# Altium project BSU.PrjPcb (part 1 of 2)
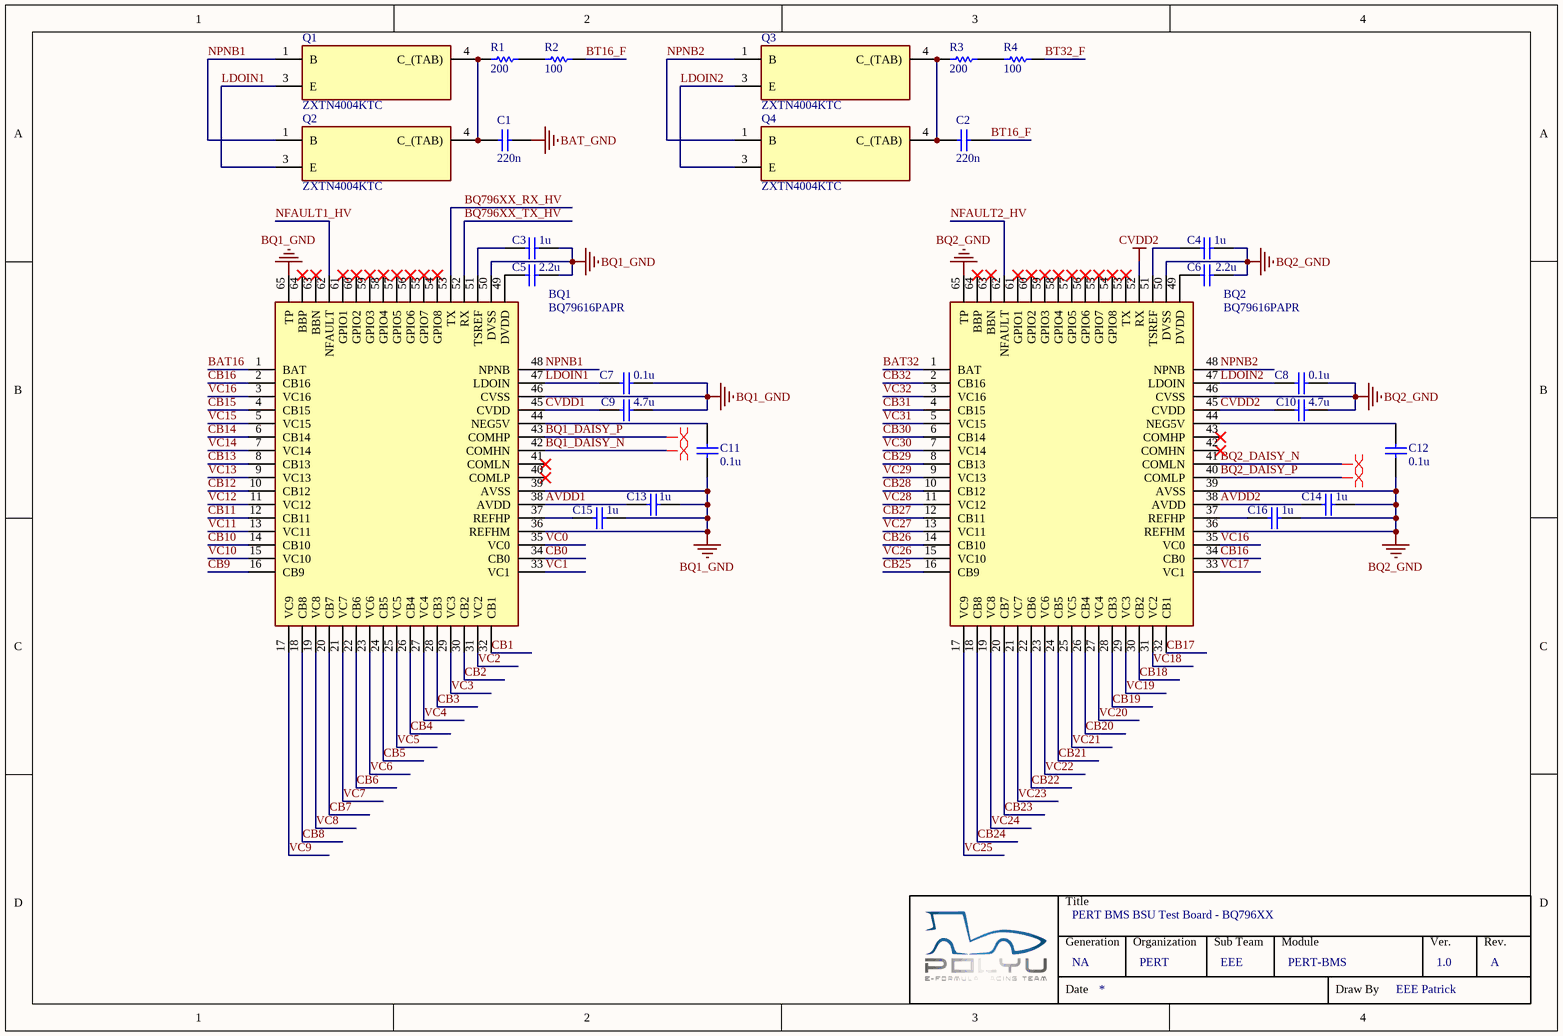
[diagram p0: BSU_BQ796XX.SchDoc]
PERTTitle: PERT BMS BSU Test Board; PERT-Version: 1.0; PERT-SubTeam: EEE; PERT-Revision: A; PERT-Organization: PERT; PERT-Module: PERT-BMS; PERT-Generation: NA; PERT-DrawBy: EEE Patrick
8 sheets, 358 parts. Net scope: global (net labels, ports and power ports of the same name join across sheets).
Board file: BSU.PcbDoc
Sheets:
  BSU_BQ796XX.SchDoc
  BSU_Connector.SchDoc
  BSU_Power.SchDoc
  BSU_Comm.SchDoc
  BSU_Sensing.SchDoc
  BSU_ESD.SchDoc
  BSU_EADC.SchDoc
  BSU_RTD.SchDoc

## Sheet BSU_BQ796XX.SchDoc: BQ796XX
size A4; Version: 1.0; Sub Team: EEE; Module: BMS; Generation: NA; Organization: PERT; SheetNumber: 1; SheetTotal: 8

### Parts
BQ1  BQ79616PAPR  [HTQFP65_BQ79616]
BQ2  BQ79616PAPR  [HTQFP65_BQ79616]
C1  220n  [1210_SMD_C]
C2  220n  [1210_SMD_C]
C3  1u  [0603_SMD_C]
C4  1u  [0603_SMD_C]
C5  2.2u  [0603_SMD_C]
C6  2.2u  [0603_SMD_C]
C7  0.1u  [0603_SMD_C]
C8  0.1u  [0603_SMD_C]
C9  4.7u  [0603_SMD_C]
C10  4.7u  [0603_SMD_C]
C11  0.1u  [0603_SMD_C]
C12  0.1u  [0603_SMD_C]
C13  1u  [0603_SMD_C]
C14  1u  [0603_SMD_C]
C15  1u  [0603_SMD_C]
C16  1u  [0603_SMD_C]
Q1  ZXTN4004KTC  [TO252-3_ZXTN4004K]
Q2  ZXTN4004KTC  [TO252-3_ZXTN4004K]
Q3  ZXTN4004KTC  [TO252-3_ZXTN4004K]
Q4  ZXTN4004KTC  [TO252-3_ZXTN4004K]
R1  200  [2010_SMD_R]
R2  100  [2010_SMD_R]
R3  200  [2010_SMD_R]
R4  100  [2010_SMD_R]

### Nets
BAT_GND: C1.2
BQ1_GND: BQ1.36(REFHM) BQ1.39(AVSS) BQ1.46(CVSS) BQ1.50(DVSS) BQ1.65(TP) C3.2 C5.2 C7.1 C9.2 C11.1 C13.1 C15.1
BQ2_GND: BQ2.36(REFHM) BQ2.39(AVSS) BQ2.46(CVSS) BQ2.50(DVSS) BQ2.65(TP) C4.2 C6.2 C8.1 C10.2 C12.1 C14.1 C16.1
CVDD1: BQ1.45(CVDD) C9.1
CVDD2: BQ2.45(CVDD) BQ2.52(RX) C10.1
AVDD1: BQ1.38(AVDD) C13.2
AVDD2: BQ2.38(AVDD) C14.2
BAT16: BQ1.1(BAT)
BAT32: BQ2.1(BAT)
BQ1_DAISY_N: BQ1.42(COMHN)
BQ1_DAISY_P: BQ1.43(COMHP)
BQ2_DAISY_N: BQ2.41(COMLN)
BQ2_DAISY_P: BQ2.40(COMLP)
BQ796XX_RX_HV: BQ1.53(TX)
BQ796XX_TX_HV: BQ1.52(RX)
BT16_F: C2.2 R2.2
BT32_F: R4.2
CB0: BQ1.34(CB0)
CB1: BQ1.32(CB1)
CB2: BQ1.30(CB2)
CB3: BQ1.28(CB3)
CB4: BQ1.26(CB4)
CB5: BQ1.24(CB5)
CB6: BQ1.22(CB6)
CB7: BQ1.20(CB7)
CB8: BQ1.18(CB8)
CB9: BQ1.16(CB9)
CB10: BQ1.14(CB10)
CB11: BQ1.12(CB11)
CB12: BQ1.10(CB12)
CB13: BQ1.8(CB13)
CB14: BQ1.6(CB14)
CB15: BQ1.4(CB15)
CB16: BQ1.2(CB16) BQ2.34(CB0)
CB17: BQ2.32(CB1)
CB18: BQ2.30(CB2)
CB19: BQ2.28(CB3)
CB20: BQ2.26(CB4)
CB21: BQ2.24(CB5)
CB22: BQ2.22(CB6)
CB23: BQ2.20(CB7)
CB24: BQ2.18(CB8)
CB25: BQ2.16(CB9)
CB26: BQ2.14(CB10)
CB27: BQ2.12(CB11)
CB28: BQ2.10(CB12)
CB29: BQ2.8(CB13)
CB30: BQ2.6(CB14)
CB31: BQ2.4(CB15)
CB32: BQ2.2(CB16)
LDOIN1: BQ1.47(LDOIN) C7.2 Q1.3(E) Q2.3(E)
LDOIN2: BQ2.47(LDOIN) C8.2 Q3.3(E) Q4.3(E)
NFAULT1_HV: BQ1.62(NFAULT)
NFAULT2_HV: BQ2.62(NFAULT)
NPNB1: BQ1.48(NPNB) Q1.1(B) Q2.1(B)
NPNB2: BQ2.48(NPNB) Q3.1(B) Q4.1(B)
VC0: BQ1.35(VC0)
VC1: BQ1.33(VC1)
VC2: BQ1.31(VC2)
VC3: BQ1.29(VC3)
VC4: BQ1.27(VC4)
VC5: BQ1.25(VC5)
VC6: BQ1.23(VC6)
VC7: BQ1.21(VC7)
VC8: BQ1.19(VC8)
VC9: BQ1.17(VC9)
VC10: BQ1.15(VC10)
VC11: BQ1.13(VC11)
VC12: BQ1.11(VC12)
VC13: BQ1.9(VC13)
VC14: BQ1.7(VC14)
VC15: BQ1.5(VC15)
VC16: BQ1.3(VC16) BQ2.35(VC0)
VC17: BQ2.33(VC1)
VC18: BQ2.31(VC2)
VC19: BQ2.29(VC3)
VC20: BQ2.27(VC4)
VC21: BQ2.25(VC5)
VC22: BQ2.23(VC6)
VC23: BQ2.21(VC7)
VC24: BQ2.19(VC8)
VC25: BQ2.17(VC9)
VC26: BQ2.15(VC10)
VC27: BQ2.13(VC11)
VC28: BQ2.11(VC12)
VC29: BQ2.9(VC13)
VC30: BQ2.7(VC14)
VC31: BQ2.5(VC15)
VC32: BQ2.3(VC16)
NetBQ1_37: BQ1.37(REFHP) C15.2
NetBQ1_44: BQ1.44(NEG5V) C11.2
NetBQ1_49: BQ1.49(DVDD) C5.1
NetBQ1_51: BQ1.51(TSREF) C3.1
NetBQ2_37: BQ2.37(REFHP) C16.2
NetBQ2_44: BQ2.44(NEG5V) C12.2
NetBQ2_49: BQ2.49(DVDD) C6.1
NetBQ2_51: BQ2.51(TSREF) C4.1
NetC1_1: C1.1 Q1.4(C_(TAB)) Q2.4(C_(TAB)) R1.1
NetC2_1: C2.1 Q3.4(C_(TAB)) Q4.4(C_(TAB)) R3.1
NetR1_2: R1.2 R2.1
NetR3_2: R3.2 R4.1

Not connected (* = marked no-connect by the designer): BQ1 40(COMLP)* 41(COMLN)* 54(GPIO8)* 55(GPIO7)* 56(GPIO6)* 57(GPIO5)* 58(GPIO4)* 59(GPIO3)* 60(GPIO2)* 61(GPIO1)* 63(BBN)* 64(BBP)*; BQ2 42(COMHN)* 43(COMHP)* 53(TX)* 54(GPIO8)* 55(GPIO7)* 56(GPIO6)* 57(GPIO5)* 58(GPIO4)* 59(GPIO3)* 60(GPIO2)* 61(GPIO1)* 63(BBN)* 64(BBP)*

### Layout directives
differential pair: BQ1_DAISY_N, BQ1_DAISY_P, BQ2_DAISY_N, BQ2_DAISY_P

### Notes on the sheet
- Title
- Generation
- Organization
- Sub Team
- Module
- Ver.
- Rev.
- Date
- Draw By

### Library data of the parts
BQ1 BQ2 = BQ79616PAPR: Battery Management 16-S precision battery monitor, balancer and integrated protector with stacking interface; Manufacturer_Name: Texas Instruments; Geometry.Height: 1.2mm; Mouser Part Number: 595-BQ79616PAPR; Mouser Price/Stock: https://www.mouser.co.uk/ProductDetail/Texas-Instruments/BQ79616PAPR?qs=1Kr7Jg1SGW8FUVDCFv5r0A%3D%3D; Manufacturer_Part_Number: BQ79616PAPR; Datasheet Link: https://www.ti.com/lit/ds/symlink/bq79616.pdf?ts=1694396292843&ref_url=https%253A%252F%252Fwww.ti.com%252Fproduct%252Fzh-tw%252FBQ79616
C1 C2 = 1210_SMD_Capacitor: 1210 SMD Capacitor; Voltage Rating: 100VDC; Tolerance: *; Dielectric: *; Value: 220n
C3-C16 = 0603_SMD_Capacitor: 0603 SMD Capacitor; Voltage Rating: 10VDC; Tolerance: *; Dielectric: *
  C3 C4 C13-C16: Value: 1u
  C5 C6: Value: 2.2u
  C7 C8 C11 C12: Value: 0.1u
  C9 C10: Value: 4.7u
Q1-Q4 = ZXTN4004KTC: Transistor; Manufacturer_Name: Diodes Incorporated; Datasheet Link: https://datasheet.datasheetarchive.com/originals/distributors/Datasheets-DGA18/1088694.pdf; Height: 2.39mm; Manufacturer_Part_Number: ZXTN4004KTC; Mouser Part Number: 621-ZXTN4004KTC; Mouser Price/Stock: https://www.mouser.co.uk/ProductDetail/Diodes-Incorporated/ZXTN4004KTC?qs=aXnpsjvrXd1NjskJTVsVYA%3D%3D; Arrow Part Number: ZXTN4004KTC; Arrow Price/Stock: https://www.arrow.com/en/products/zxtn4004ktc/diodes-incorporated?region=asia
R1-R4 = 2010_SMD_Resistor: 2010 SMD Resistor; Tolerance: *; Power Rating: *; Temperature Coefficient: *
  R1 R3: Value: 200
  R2 R4: Value: 100

## Sheet BSU_Connector.SchDoc: Connector
size A4; Version: 1.0; Sub Team: EEE; Module: PERT-BMS; Generation: NA; Organization: PERT; SheetNumber: 2; SheetTotal: 8
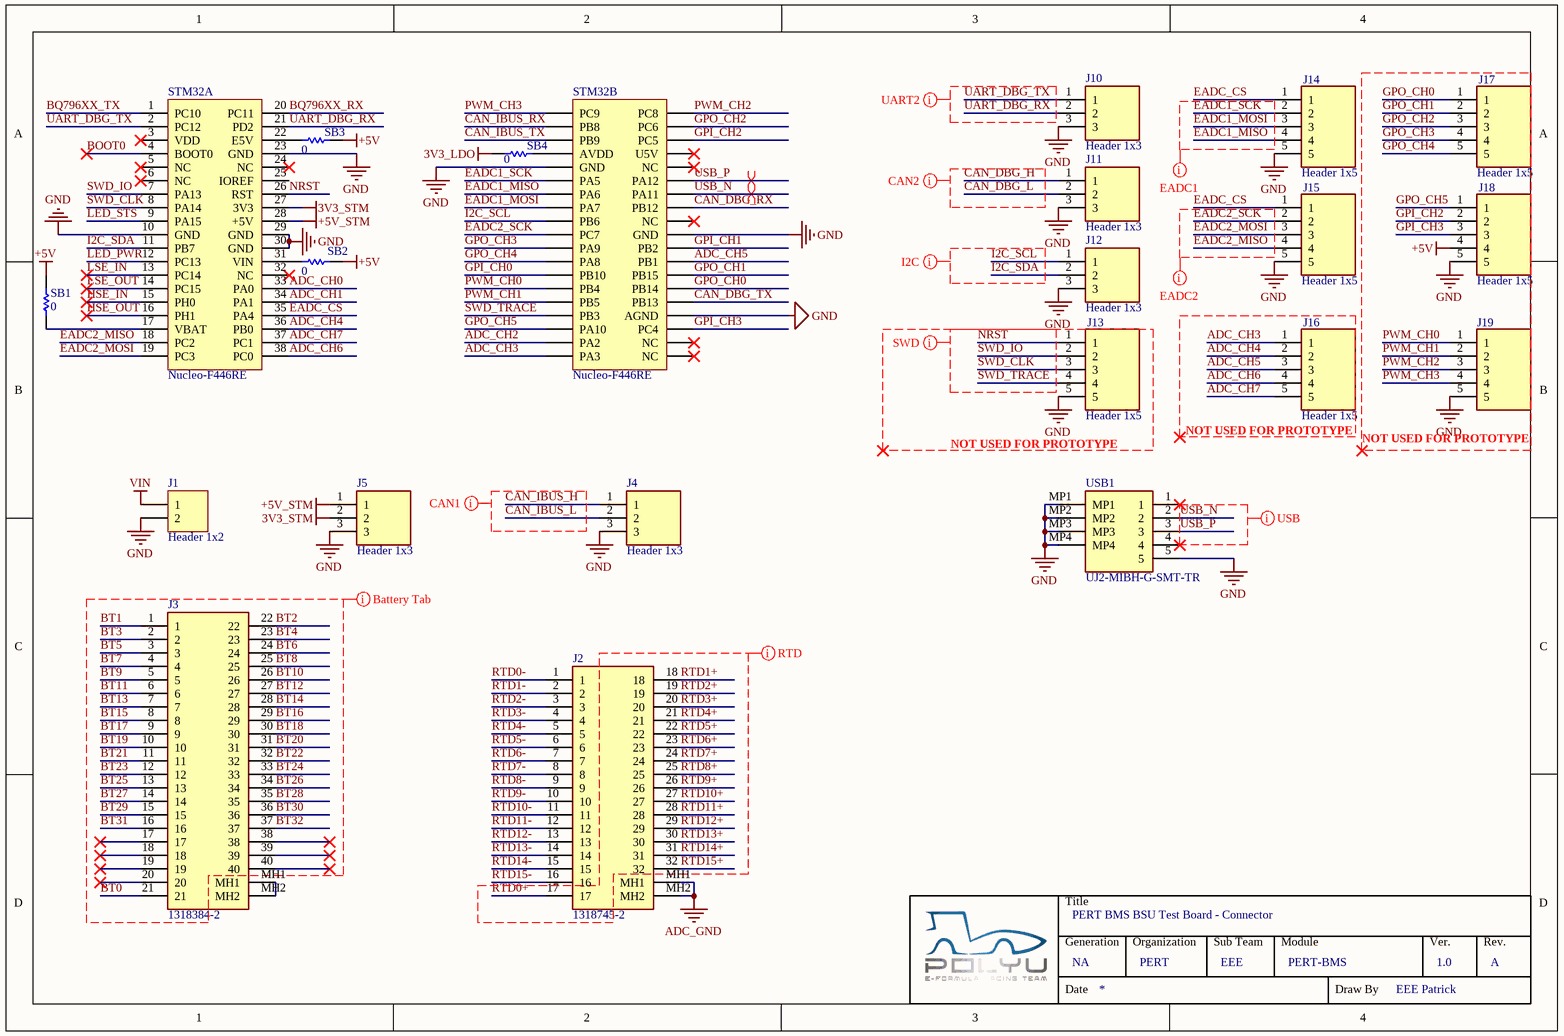
[diagram p1: BSU_Connector.SchDoc]

### Parts
J1  Header 1x2  [HDR_1X2_2.54_THD]
J2  1318745-2  [TH025_32P]
J3  1318384-2  [TH025_40P]
J4  Header 1x3  [HDR_1X3_2.54_THD]
J5  Header 1x3  [HDR_1X3_2.54_THD]
J10  Header 1x3  [HDR_1X3_2.54_THD]
J11  Header 1x3  [HDR_1X3_2.54_THD]
J12  Header 1x3  [HDR_1X3_2.54_THD]
J13  Header 1x5  [HDR_1X5_2.54_THD]  (graphical)
J14  Header 1x5  [HDR_1X5_2.54_THD]
J15  Header 1x5  [HDR_1X5_2.54_THD]
J16  Header 1x5  [HDR_1X5_2.54_THD]  (graphical)
J17  Header 1x5  [HDR_1X5_2.54_THD]  (graphical)
J18  Header 1x5  [HDR_1X5_2.54_THD]  (graphical)
J19  Header 1x5  [HDR_1X5_2.54_THD]  (value not drawn)  (graphical)
SB1  0  [0805_SMD_R]
SB2  0  [0805_SMD_R]
SB3  0  [0805_SMD_R]
SB4  0  [0805_SMD_R]
STM32  Nucleo-F446RE  [NUCLEO-F446RE]  (parts A,B of 2)  (no BOM)
USB1  UJ2-MIBH-G-SMT-TR  [USB_B_5P_SMD]

### Nets
3V3_LDO: SB4.2
3V3_STM: J5.2 STM32.27(3V3)
+5V: J18.4 SB1.2 SB2.1 SB3.1
+5V_STM: J5.1 STM32.28(+5V)
GND: J1.2 J4.3 J5.3 J10.3 J11.3 J12.3 J13.5 J14.5 J15.5 J18.5 J19.5 STM32.10(GND) STM32.23(GND) STM32.29(GND) STM32.30(GND) STM32.43(GND) STM32.67(GND) STM32.73(AGND) USB1.5 USB1.MP1 USB1.MP2 USB1.MP3 USB1.MP4
RTD0-: J2.1 J2.2 J2.3 J2.4 J2.5 J2.6 J2.7 J2.8 J2.9 J2.10 J2.11 J2.12 J2.13 J2.14 J2.15 J2.16 J2.MH1 J2.MH2  [also labelled ADC_GND, RTD1-, RTD10-, RTD11-, RTD12-, RTD13-, RTD14-, RTD15-, RTD2-, RTD3-, RTD4-, RTD5-, RTD6-, RTD7-, RTD8-, RTD9-]
VIN: J1.1
ADC_CH0: STM32.33(PA0)
ADC_CH1: STM32.34(PA1)
ADC_CH2: STM32.56(PA2)
ADC_CH3: J16.1 STM32.57(PA3)
ADC_CH4: J16.2 STM32.36(PB0)
ADC_CH5: J16.3 STM32.69(PB1)
ADC_CH6: J16.4 STM32.38(PC0)
ADC_CH7: J16.5 STM32.37(PC1)
BOOT0: STM32.4(BOOT0)
BQ796XX_RX: STM32.20(PC11)
BQ796XX_TX: STM32.1(PC10)
BT0: J3.21
BT1: J3.1
BT2: J3.22
BT3: J3.2
BT4: J3.23
BT5: J3.3
BT6: J3.24
BT7: J3.4
BT8: J3.25
BT9: J3.5
BT10: J3.26
BT11: J3.6
BT12: J3.27
BT13: J3.7
BT14: J3.28
BT15: J3.8
BT16: J3.29
BT17: J3.9
BT18: J3.30
BT19: J3.10
BT20: J3.31
BT21: J3.11
BT22: J3.32
BT23: J3.12
BT24: J3.33
BT25: J3.13
BT26: J3.34
BT27: J3.14
BT28: J3.35
BT29: J3.15
BT30: J3.36
BT31: J3.16
BT32: J3.37
CAN_DBG_H: J11.1
CAN_DBG_L: J11.2
CAN_DBG_RX: STM32.65(PB12)
CAN_DBG_TX: STM32.72(PB13)
CAN_IBUS_H: J4.1
CAN_IBUS_L: J4.2
CAN_IBUS_RX: STM32.40(PB8)
CAN_IBUS_TX: STM32.41(PB9)
EADC1_MISO: J14.4 STM32.45(PA6)
EADC1_MOSI: J14.3 STM32.46(PA7)
EADC1_SCK: J14.2 STM32.44(PA5)
EADC2_MISO: J15.4 STM32.18(PC2)
EADC2_MOSI: J15.3 STM32.19(PC3)
EADC2_SCK: J15.2 STM32.48(PC7)
EADC_CS: J14.1 J15.1 STM32.35(PA4)
GPI_CH0: STM32.51(PB10)
GPI_CH1: STM32.68(PB2)
GPI_CH2: J18.2 STM32.60(PC5)
GPI_CH3: J18.3 STM32.74(PC4)
GPO_CH0: J17.1 STM32.71(PB14)
GPO_CH1: J17.2 STM32.70(PB15)
GPO_CH2: J17.3 STM32.59(PC6)
GPO_CH3: J17.4 STM32.49(PA9)
GPO_CH4: J17.5 STM32.50(PA8)
GPO_CH5: J18.1 STM32.55(PA10)
HSE_IN: STM32.15(PH0)
HSE_OUT: STM32.16(PH1)
I2C_SCL: J12.1 STM32.47(PB6)
I2C_SDA: J12.2 STM32.11(PB7)
LED_PWR: STM32.12(PC13)
LED_STS: STM32.9(PA15)
LSE_IN: STM32.13(PC14)
LSE_OUT: STM32.14(PC15)
NRST: J13.1 STM32.26(RST)
PWM_CH0: J19.1 STM32.52(PB4)
PWM_CH1: J19.2 STM32.53(PB5)
PWM_CH2: J19.3 STM32.58(PC8)
PWM_CH3: J19.4 STM32.39(PC9)
RTD0+: J2.17
RTD1+: J2.18
RTD2+: J2.19
RTD3+: J2.20
RTD4+: J2.21
RTD5+: J2.22
RTD6+: J2.23
RTD7+: J2.24
RTD8+: J2.25
RTD9+: J2.26
RTD10+: J2.27
RTD11+: J2.28
RTD12+: J2.29
RTD13+: J2.30
RTD14+: J2.31
RTD15+: J2.32
SWD_CLK: J13.3 STM32.8(PA14)
SWD_IO: J13.2 STM32.7(PA13)
SWD_TRACE: J13.4 STM32.54(PB3)
UART_DBG_RX: J10.2 STM32.21(PD2)
UART_DBG_TX: J10.1 STM32.2(PC12)
USB_N: STM32.64(PA11) USB1.2
USB_P: STM32.63(PA12) USB1.3
NetJ3_MH1: J3.MH1 J3.MH2
NetSB1_1: SB1.1 STM32.17(VBAT)
NetSB2_2: SB2.2 STM32.31(VIN)
NetSB3_2: SB3.2 STM32.22(E5V)
NetSB4_1: SB4.1 STM32.42(AVDD)

Not connected (* = marked no-connect by the designer): J3 17* 18* 19* 20* 38* 39* 40*; STM32 3(VDD)* 5(NC)* 6(NC)* 24(NC)* 25(IOREF) 32(NC)* 61(U5V)* 62(NC)* 66(NC)* 75(NC)* 76(NC)*; USB1 1* 4*

### Layout directives
differential pair: USB_N, USB_P
net class SWD; rule Matched Net Lengths [Tolerance = 1mm]: NRST, SWD_CLK, SWD_IO, SWD_TRACE
net class I2C; rule Matched Net Lengths [Tolerance = 1mm]: I2C_SCL, I2C_SDA
net class CAN2_DIFF; rule Differential Pairs Routing [Pref Gap = 0.254mm    Min Gap  = 0.127mm    Max Gap  = 0.254mmPref Width = 0.254mm    Min Width  = 0.127mm    Max Width  = 0.381mm]: CAN_DBG_H, CAN_DBG_L
net class UART2; rule Matched Net Lengths [Tolerance = 1mm]: UART_DBG_RX, UART_DBG_TX
net class USB; rule Matched Net Lengths [Tolerance = 1mm]: USB_N, USB_P
net class CAN1_DIFF; rule Differential Pairs Routing [Pref Gap = 0.254mm    Min Gap  = 0.127mm    Max Gap  = 0.254mmPref Width = 0.254mm    Min Width  = 0.127mm    Max Width  = 0.381mm]: CAN_IBUS_H, CAN_IBUS_L
net class EADC1; rule Matched Net Lengths [Tolerance = 1mm]: EADC1_MISO, EADC1_MOSI, EADC1_SCK
net class EADC2; rule Matched Net Lengths [Tolerance = 1mm]: EADC2_MISO, EADC2_MOSI, EADC2_SCK
net class BT: BT0, BT1, BT2, BT3, BT4, BT5, BT6, BT7, BT8, BT9, BT10, BT11, BT12, BT13, BT14, BT15, BT16, BT17, BT18, BT19, BT20, BT21, BT22, BT23, BT24, BT25, BT26, BT27, BT28, BT29, BT30, BT31, BT32
net class RTD: RTD0+, RTD1+, RTD2+, RTD3+, RTD4+, RTD5+, RTD6+, RTD7+, RTD8+, RTD9+, RTD10+, RTD11+, RTD12+, RTD13+, RTD14+, RTD15+

### Notes on the sheet
- NOT USED FOR PROTOTYPE
- (near J16) NOT USED FOR PROTOTYPE
- (near J19) NOT USED FOR PROTOTYPE
- Title
- Generation
- Organization
- Sub Team
- Module
- Ver.
- Rev.
- Date
- Draw By

### Library data of the parts
J1 = Header 1x2: Header, 2-Pin
J2 = TE TH/.25 32P TH: TE CONNECTIVITY - 1318745-2 - Automotive Connector, TH 025 Series, Right Angle Plug, 32 Contacts, Crimp Pin; Geometry.Height: 15.5mm; Mouser Part Number: 571-1318745-2; Mouser Price/Stock: https://www.mouser.co.uk/ProductDetail/TE-Connectivity-AMP/1318745-2?qs=ajJfoEgdyuQ%2FBs4LKkUxbA%3D%3D; Manufacturer_Name: TE Connectivity; Manufacturer_Part_Number: 1318745-2; Datasheet Link: https://www.te.com/commerce/DocumentDelivery/DDEController?Action=showdoc&DocId=Customer+Drawing%7F1318745%7FB6%7Fpdf%7FJapanese%7FJPN_CD_1318745_B6.pdf%7F1318745-2
J3 = TE TH/.25 40P TH: TE Connectivity TH 025 Series, 2 Row 40 Way Through Hole Socket Automotive Header Connector, Automotive wiring; Geometry.Height: 15.5mm; Mouser Part Number: 571-1318384-2; Mouser Price/Stock: https://www.mouser.co.uk/ProductDetail/TE-Connectivity/1318384-2?qs=ajJfoEgdyuQdiyFC%2FqjiIw%3D%3D; Manufacturer_Name: TE Connectivity; Manufacturer_Part_Number: 1318384-2; Datasheet Link: https://datasheet.datasheetarchive.com/originals/distributors/Datasheets_SAMA/2d817f87a4b79b3277c4981d7cac1338.pdf
J4 J5 J10-J12 = Header 1x3: Pin Header 2.54mm Pitch STR DIP, 1x3Pin, G/F, LCP, 8.08mm*2.54mm*3.18mm, Color-Black, Bag; Manufacturer_Name: Amphenol Communications Solutions; Manufacturer_Part_Number: G800LR305018EU; Geometry.Height: 10.82mm; Mouser Part Number: 523-G800LR305018EU; Mouser Price/Stock: https://www.mouser.co.uk/ProductDetail/Amphenol-Commercial-Products/G800LR305018EU?qs=PzGy0jfpSMsZaVkTJmYyRA%3D%3D; Datasheet Link: https://cdn.amphenol-cs.com/media/wysiwyg/files/drawing/g800lrxxxxxxeu_1.pdf
J13-J19 = Header 1x5: Manufacturer_Name: TE Connectivity; Manufacturer_Part_Number: 87224-5; Geometry.Height: 10.745mm; Datasheet Link: https://www.arrow.com/en/products/87224-5/te-connectivity
SB1-SB4 = 0805_SMD_Resistor: 0805 SMD Resistor; Tolerance: *; Power Rating: *; Temperature Coefficient: *; Value: 0
USB1 = USB_B 5P: USB Connectors USB jack, 2.0, micro B type, 5 pin, horizontal, gold flash, SMT, TR; Manufacturer_Name: CUI Devices; Geometry.Height: 3.15mm; Mouser Part Number: 490-UJ2-MIBH-G-SMTTR; Mouser Price/Stock: https://www.mouser.co.uk/ProductDetail/CUI-Devices/UJ2-MIBH-G-SMT-TR?qs=IS%252B4QmGtzzpvS1XQusp0iA%3D%3D; Manufacturer_Part_Number: UJ2-MIBH-G-SMT-TR; Datasheet Link: cuidevices.com/product/resource/uj2-mibh-g-smt-tr.pdf

## Sheet BSU_Power.SchDoc: Power
size A4; Sub Team: EEE; Organization: PERT; SheetNumber: 3; SheetTotal: 8
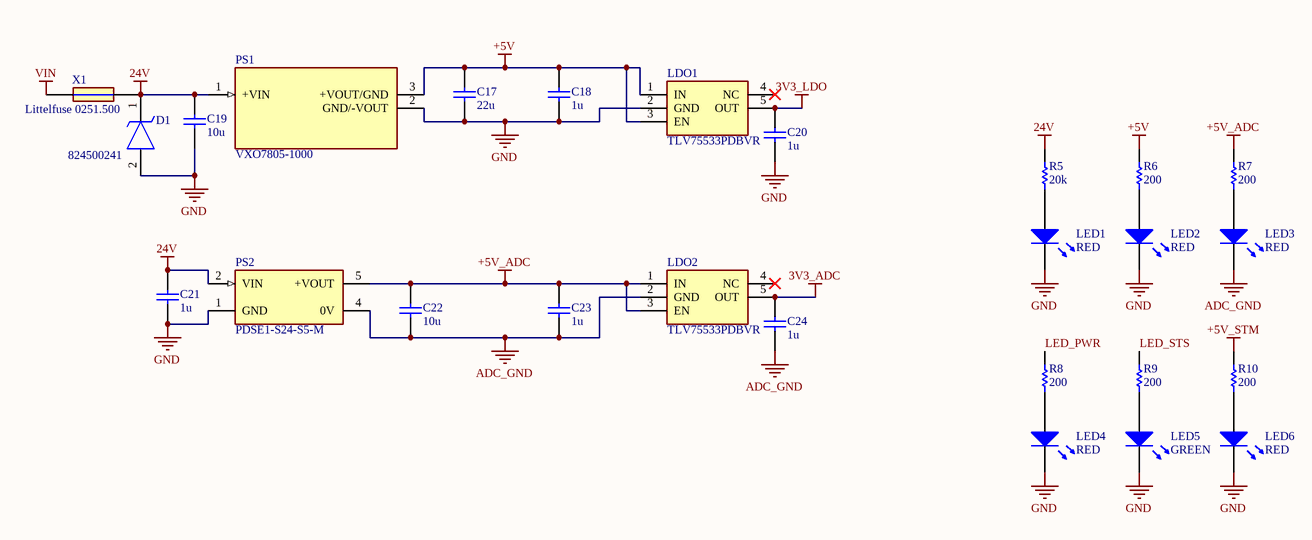
[diagram p2: BSU_Power.SchDoc]

### Parts
C17  22u  [0805_SMD_C]
C18  1u  [0805_SMD_C]
C19  10u  [0805_SMD_C]
C20  1u  [0805_SMD_C]
C21  1u  [0805_SMD_C]
C22  10u  [0805_SMD_C]
C23  1u  [0805_SMD_C]
C24  1u  [0805_SMD_C]
D1  824500241  [SMA_824500241]
LDO1  TLV75533PDBVR  [SOT23-5_TLV75533]
LDO2  TLV75533PDBVR  [SOT23-5_TLV75533]
LED1  RED  [0805_SMD_LED]
LED2  RED  [0805_SMD_LED]
LED3  RED  [0805_SMD_LED]
LED4  RED  [0805_SMD_LED]
LED5  GREEN  [0805_SMD_LED]
LED6  RED  [0805_SMD_LED]
PS1  VXO7805-1000  [VXO78xx-1000]
PS2  PDSE1-S24-S5-M  [PDSE1-Sxx-Sx-M]
R5  20k  [0805_SMD_R]
R6  200  [0805_SMD_R]
R7  200  [0805_SMD_R]
R8  200  [0805_SMD_R]
R9  200  [0805_SMD_R]
R10  200  [0805_SMD_R]
X1  Littelfuse 0251.500  [LITTELFUSE 0251]

### Nets
3V3_ADC: C24.2 LDO2.5(OUT)
3V3_LDO: C20.2 LDO1.5(OUT)
24V: C19.2 C21.2 D1.1(K) PS1.1(+VIN) PS2.2(VIN) R5.2 X1.2
+5V: C17.2 C18.2 LDO1.1(IN) LDO1.3(EN) PS1.3(+VOUT/GND) R6.2
+5V_ADC: C22.2 C23.2 LDO2.1(IN) LDO2.3(EN) PS2.5(+VOUT) R7.2
+5V_STM: R10.2
ADC_GND: C22.1 C23.1 C24.1 LDO2.2(GND) LED3.1 PS2.4(0V)  [project net RTD0-]
GND: C17.1 C18.1 C19.1 C20.1 C21.1 D1.2(A) LDO1.2(GND) LED1.1 LED2.1 LED4.1 LED5.1 LED6.1 PS1.2(GND/-VOUT) PS2.1(GND)
VIN: X1.1
LED_PWR: R8.2
LED_STS: R9.2
NetLED1_2: LED1.2 R5.1
NetLED2_2: LED2.2 R6.1
NetLED3_2: LED3.2 R7.1
NetLED4_2: LED4.2 R8.1
NetLED5_2: LED5.2 R9.1
NetLED6_2: LED6.2 R10.1

Not connected (* = marked no-connect by the designer): LDO1 4(NC)*; LDO2 4(NC)*

### Notes on the sheet
- Title
- Generation
- Organization
- Sub Team
- Module
- Ver.
- Rev.
- Date
- Draw By

### Library data of the parts
C17 C18 C22 C23 = 0805_SMD_Capacitor: 0805 SMD Capacitor; Voltage Rating: 16VDC; Tolerance: *; Dielectric: *
  C17: Value: 22u
  C18 C23: Value: 1u
  C22: Value: 10u
C19 C21 = 0805_SMD_Capacitor: 0805 SMD Capacitor; Voltage Rating: 50VDC; Tolerance: *; Dielectric: *
  C19: Value: 10u
  C21: Value: 1u
C20 C24 = 0805_SMD_Capacitor: 0805 SMD Capacitor; Voltage Rating: 10VDC; Tolerance: *; Dielectric: *; Value: 1u
D1 = 824500241: TVS Diode (Uni-directional); Manufacturer_Name: Wurth Elektronik; Datasheet Link: https://componentsearchengine.com/Datasheets/2/824500241.pdf; Height: 2.5mm; Manufacturer_Part_Number: 824500241; Mouser Part Number: 710-824500241; Mouser Price/Stock: https://www.mouser.co.uk/ProductDetail/Wurth-Elektronik/824500241?qs=16w8nSHsg3swPBRQBjzwDQ%3D%3D
LDO1 LDO2 = 3V 500mA LDO: LDO Voltage Regulators 500-mA, Low IQ, Small Size, Low Dropout Regulator 5-SOT-23 -40 to 125; Manufacturer_Name: Texas Instruments; Geometry.Height: 1.45mm; Mouser Part Number: 595-TLV75533PDBVR; Mouser Price/Stock: https://www.mouser.co.uk/ProductDetail/Texas-Instruments/TLV75533PDBVR?qs=55YtniHzbhAKEwqeO2xJXQ%3D%3D; Manufacturer_Part_Number: TLV75533PDBVR; Datasheet Link: http://www.ti.com/lit/gpn/tlv755p
LED1-LED6 = 0805 LED Generic: SMD LED
PS1 = 24-5 Power Converter: CUI Inc.,1 A Output Current, 6~36 Vdc Input, 3 Pin SIP, Non-Isolated, Dc-Dc Converter; MF: CUI Inc.; Package: SIP-3; Value: *; Price: None; MP: VXO7805-1000; SnapEDA_Link: https://www.snapeda.com/parts/VXO7805-1000/CUI/view-part/2679745/?ref=snap; Availability: Unavailable; Supplier 1: Mouser; Supplier 2: Digi-Key; Supplier Part Number 2: 102-4258-ND; Supplier Part Number 1: 490-VXO7805-1000
PS2 = 24-5 Isolated Power Converter: CUI Inc., DC-DC ISOLATED, 5VDC input, 1 W, 4.5-5.5 VDC; MF: {'manufacturer': u'CUI'}; Availability: Unavailable; Package: None; MP: PDSE1-S24-S5-M; Value: *; Price: None; Supplier 1: Mouser; Supplier 2: Digi-Key; Supplier Part Number 1: 490-PDSE1-S24-S5-M; Supplier Part Number 2: 102-PDSE1-S24-S5-M-ND
R5-R10 = 0805_SMD_Resistor: 0805 SMD Resistor; Tolerance: *; Power Rating: *; Temperature Coefficient: *
  R5: Value: 20k
  R6-R10: Value: 200
X1 = LV Fuse 500mA: Littelfuse 251 series 125VAC/125VDC 500mA

## Sheet BSU_Comm.SchDoc: Communication
size A4; Sub Team: EEE; Organization: PERT; SheetNumber: 4; SheetTotal: 8
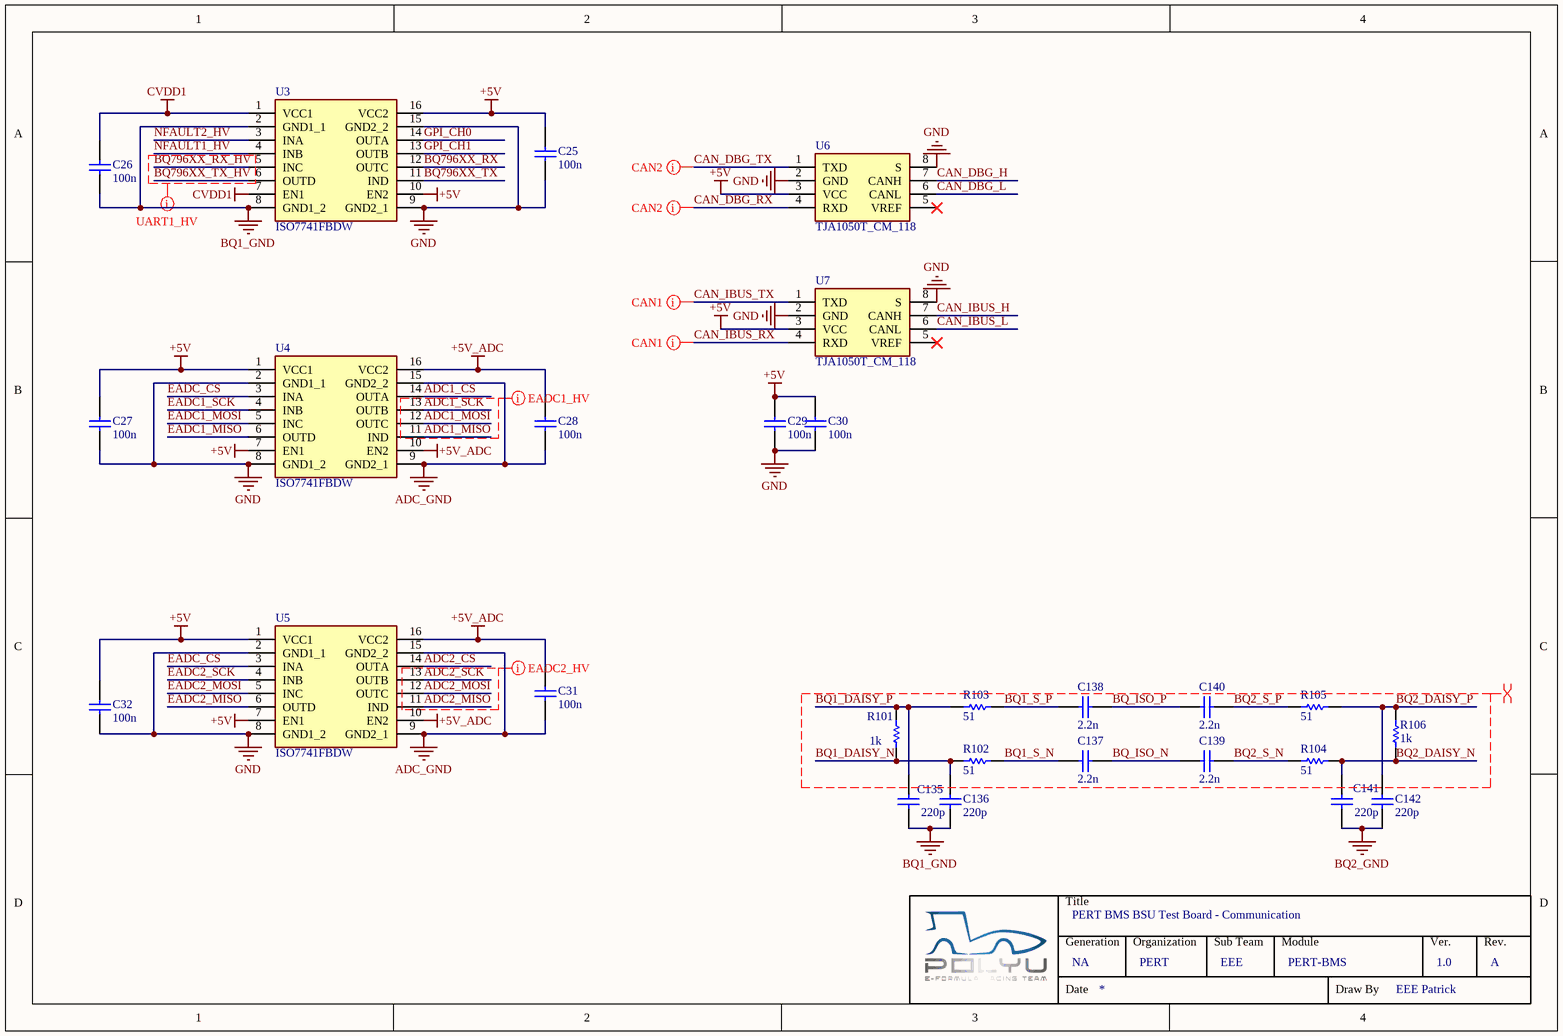
[diagram p3: BSU_Comm.SchDoc]

### Parts
C25  100n  [0805_SMD_C]
C26  100n  [0805_SMD_C]
C27  100n  [0805_SMD_C]
C28  100n  [0805_SMD_C]
C29  100n  [0805_SMD_C]
C30  100n  [0805_SMD_C]
C31  100n  [0805_SMD_C]
C32  100n  [0805_SMD_C]
C135  220p  [0603_SMD_C]
C136  220p  [0603_SMD_C]
C137  2.2n  [0603_SMD_C]
C138  2.2n  [0603_SMD_C]
C139  2.2n  [0603_SMD_C]
C140  2.2n  [0603_SMD_C]
C141  220p  [0603_SMD_C]
C142  220p  [0603_SMD_C]
R101  1k  [0603_SMD_R]
R102  51  [0603_SMD_R]
R103  51  [0603_SMD_R]
R104  51  [0603_SMD_R]
R105  51  [0603_SMD_R]
R106  1k  [0603_SMD_R]
U3  ISO7741FBDW  [SOIC16_ISO7741]
U4  ISO7741FBDW  [SOIC16_ISO7741]
U5  ISO7741FBDW  [SOIC16_ISO7741]
U6  TJA1050T_CM_118  [SOIC8_TJA1050]
U7  TJA1050T_CM_118  [SOIC8_TJA1050]

### Nets
+5V: C25.2 C27.2 C29.2 C30.2 C32.2 U3.10(EN2) U3.16(VCC2) U4.1(VCC1) U4.7(EN1) U5.1(VCC1) U5.7(EN1) U6.3(VCC) U7.3(VCC)
+5V_ADC: C28.2 C31.2 U4.10(EN2) U4.16(VCC2) U5.10(EN2) U5.16(VCC2)
ADC_GND: C28.1 C31.1 U4.9(GND2_1) U4.15(GND2_2) U5.9(GND2_1) U5.15(GND2_2)  [project net RTD0-]
BQ1_GND: C26.1 C135.1 C136.1 U3.2(GND1_1) U3.8(GND1_2)
BQ2_GND: C141.1 C142.1
CVDD1: C26.2 U3.1(VCC1) U3.7(EN1)
GND: C25.1 C27.1 C29.1 C30.1 C32.1 U3.9(GND2_1) U3.15(GND2_2) U4.2(GND1_1) U4.8(GND1_2) U5.2(GND1_1) U5.8(GND1_2) U6.2(GND) U6.8(S) U7.2(GND) U7.8(S)
ADC1_CS: U4.14(OUTA)
ADC1_MISO: U4.11(IND)
ADC1_MOSI: U4.12(OUTC)
ADC1_SCK: U4.13(OUTB)
ADC2_CS: U5.14(OUTA)
ADC2_MISO: U5.11(IND)
ADC2_MOSI: U5.12(OUTC)
ADC2_SCK: U5.13(OUTB)
BQ1_DAISY_N: C136.2 R101.2 R102.2
BQ1_DAISY_P: C135.2 R101.1 R103.2
BQ1_S_N: C137.2 R102.1
BQ1_S_P: C138.2 R103.1
BQ2_DAISY_N: C141.2 R104.2 R106.1
BQ2_DAISY_P: C142.2 R105.2 R106.2
BQ2_S_N: C139.2 R104.1
BQ2_S_P: C140.2 R105.1
BQ796XX_RX: U3.12(OUTC)
BQ796XX_RX_HV: U3.5(INC)
BQ796XX_TX: U3.11(IND)
BQ796XX_TX_HV: U3.6(OUTD)
BQ_ISO_N: C137.1 C139.1
BQ_ISO_P: C138.1 C140.1
CAN_DBG_H: U6.7(CANH)
CAN_DBG_L: U6.6(CANL)
CAN_DBG_RX: U6.4(RXD)
CAN_DBG_TX: U6.1(TXD)
CAN_IBUS_H: U7.7(CANH)
CAN_IBUS_L: U7.6(CANL)
CAN_IBUS_RX: U7.4(RXD)
CAN_IBUS_TX: U7.1(TXD)
EADC1_MISO: U4.6(OUTD)
EADC1_MOSI: U4.5(INC)
EADC1_SCK: U4.4(INB)
EADC2_MISO: U5.6(OUTD)
EADC2_MOSI: U5.5(INC)
EADC2_SCK: U5.4(INB)
EADC_CS: U4.3(INA) U5.3(INA)
GPI_CH0: U3.14(OUTA)
GPI_CH1: U3.13(OUTB)
NFAULT1_HV: U3.4(INB)
NFAULT2_HV: U3.3(INA)

Not connected (* = marked no-connect by the designer): U6 5(VREF)*; U7 5(VREF)*

### Layout directives
differential pair; differential pair class BQ_DAISY; net class BQ_DAISY: BQ1_DAISY_N, BQ1_DAISY_P, BQ1_S_N, BQ1_S_P, BQ2_DAISY_N, BQ2_DAISY_P, BQ2_S_N, BQ2_S_P, BQ_ISO_N, BQ_ISO_P
net class UART1_HV; rule Matched Net Lengths [Tolerance = 1mm]: BQ796XX_RX_HV, BQ796XX_TX_HV
net class EADC1_HV; rule Matched Net Lengths [Tolerance = 1mm]: ADC1_MISO, ADC1_MOSI, ADC1_SCK
net class EADC2_HV; rule Matched Net Lengths [Tolerance = 1mm]: ADC2_MISO, ADC2_MOSI, ADC2_SCK
net class CAN2; rule Matched Net Lengths [Tolerance = 1mm]: CAN_DBG_RX, CAN_DBG_TX
net class CAN1; rule Matched Net Lengths [Tolerance = 1mm]: CAN_IBUS_RX, CAN_IBUS_TX

### Notes on the sheet
- Title
- Generation
- Organization
- Sub Team
- Module
- Ver.
- Rev.
- Date
- Draw By

### Library data of the parts
C25-C32 = 0805_SMD_Capacitor: as C17 on sheet BSU_Power; Tolerance: *; Dielectric: *; Value: 100n
C135 C136 C141 C142 = 0603_SMD_Capacitor: 0603 SMD Capacitor; Voltage Rating: 50VDC; Tolerance: *; Dielectric: *; Value: 220p
C137-C140 = 0603_SMD_Capacitor: 0603 SMD Capacitor; Voltage Rating: 100VDC; Tolerance: *; Dielectric: *; Value: 2.2n
R101-R106 = 0603_SMD_Resistor: 0603 SMD Resistor; Tolerance: *; Power Rating: *; Temperature Coefficient: *
  R101 R106: Value: 1k
  R102-R105: Value: 51
U3-U5 = ISO7741FBDW: Digital Isolators Robust EMC, quad-channel, 3/1, reinforced digital isolator 16-SOIC -55 to 125; Manufacturer_Name: Texas Instruments; Geometry.Height: 2.65mm; Mouser Part Number: 595-ISO7741FBDW; Mouser Price/Stock: https://www.mouser.co.uk/ProductDetail/Texas-Instruments/ISO7741FBDW?qs=MLItCLRbWsxUdn9iEHVJVg%3D%3D; Manufacturer_Part_Number: ISO7741FBDW; Datasheet Link: https://www.ti.com/lit/gpn/iso7741
U6 U7 = TJA1050T: NXP - TJA1050T/CM,118 - CAN TRANSCEIVER, 1TX/RX, SOIC-8; Geometry.Height: 1.75mm; Mouser Part Number: 771-TJA1050T/CM118; Mouser Price/Stock: https://www.mouser.co.uk/ProductDetail/NXP-Semiconductors/TJA1050T-CM118?qs=5XOdhvmYM0NFFspw0VP5sA%3D%3D; Manufacturer_Name: NXP; Manufacturer_Part_Number: TJA1050T/CM,118; Datasheet Link: http://www.nxp.com/docs/en/data-sheet/TJA1050.pdf

## Sheet BSU_Sensing.SchDoc: Sensing
size A4; Sub Team: EEE; Organization: PERT; SheetNumber: 5; SheetTotal: 8
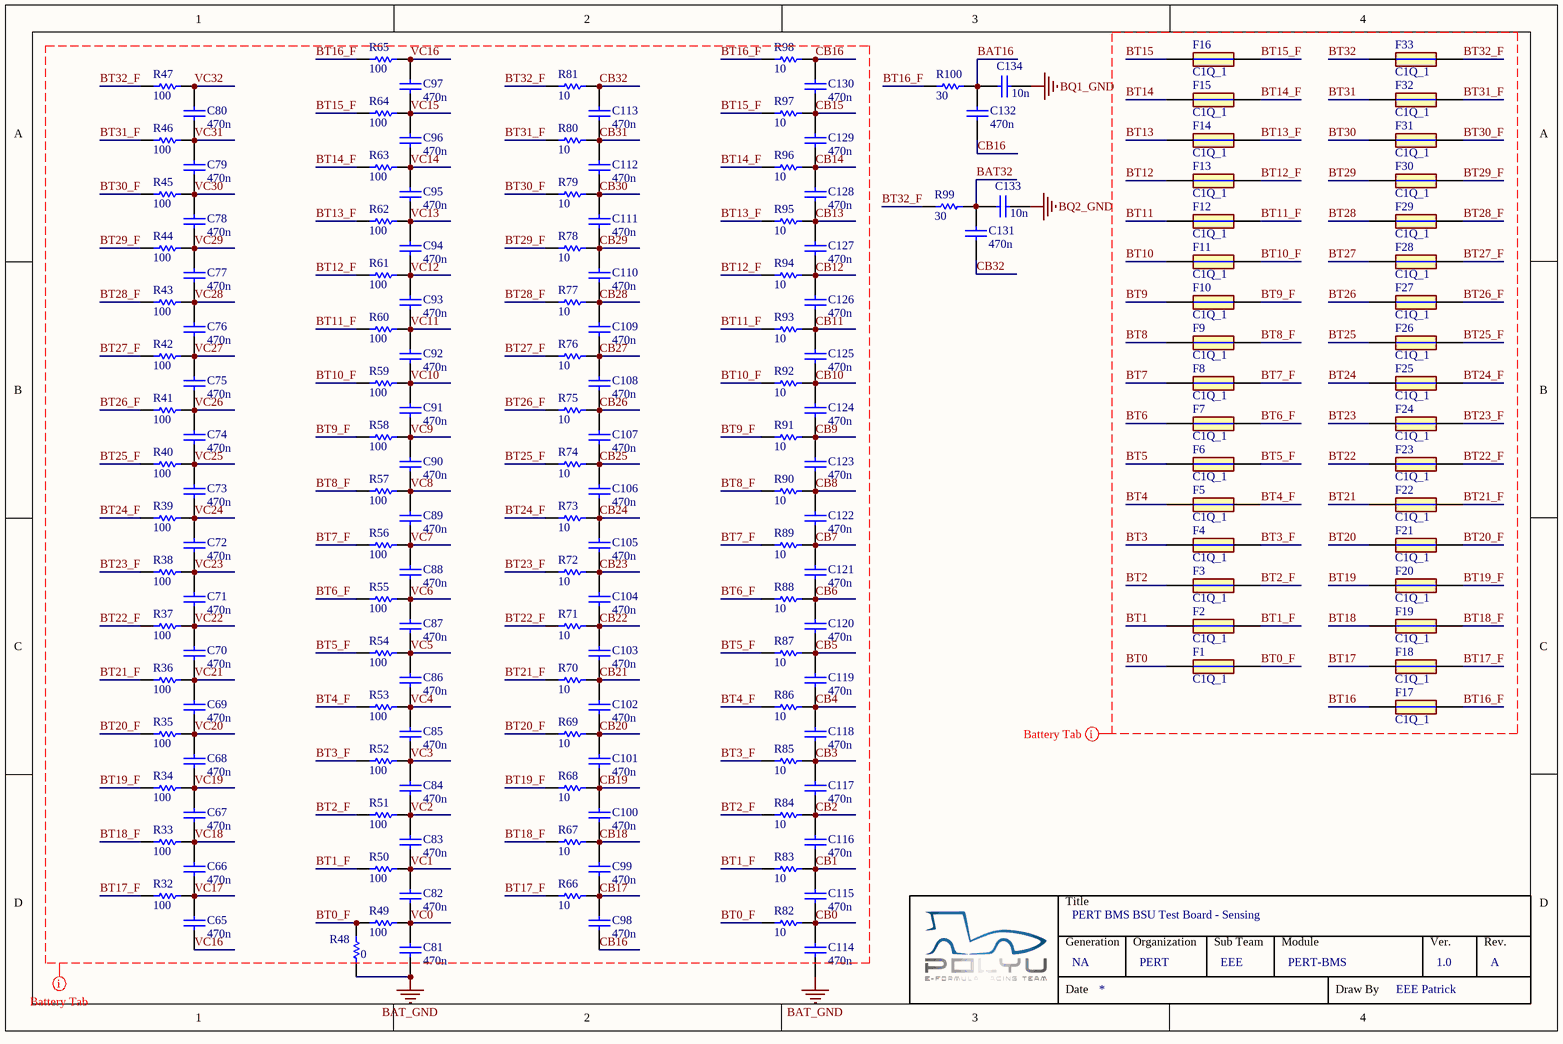
[diagram p4: BSU_Sensing.SchDoc]

### Parts
C65  470n  [0603_SMD_C]
C66  470n  [0603_SMD_C]
C67  470n  [0603_SMD_C]
C68  470n  [0603_SMD_C]
C69  470n  [0603_SMD_C]
C70  470n  [0603_SMD_C]
C71  470n  [0603_SMD_C]
C72  470n  [0603_SMD_C]
C73  470n  [0603_SMD_C]
C74  470n  [0603_SMD_C]
C75  470n  [0603_SMD_C]
C76  470n  [0603_SMD_C]
C77  470n  [0603_SMD_C]
C78  470n  [0603_SMD_C]
C79  470n  [0603_SMD_C]
C80  470n  [0603_SMD_C]
C81  470n  [0603_SMD_C]
C82  470n  [0603_SMD_C]
C83  470n  [0603_SMD_C]
C84  470n  [0603_SMD_C]
C85  470n  [0603_SMD_C]
C86  470n  [0603_SMD_C]
C87  470n  [0603_SMD_C]
C88  470n  [0603_SMD_C]
C89  470n  [0603_SMD_C]
C90  470n  [0603_SMD_C]
C91  470n  [0603_SMD_C]
C92  470n  [0603_SMD_C]
C93  470n  [0603_SMD_C]
C94  470n  [0603_SMD_C]
C95  470n  [0603_SMD_C]
C96  470n  [0603_SMD_C]
C97  470n  [0603_SMD_C]
C98  470n  [0603_SMD_C]
C99  470n  [0603_SMD_C]
C100  470n  [0603_SMD_C]
C101  470n  [0603_SMD_C]
C102  470n  [0603_SMD_C]
C103  470n  [0603_SMD_C]
C104  470n  [0603_SMD_C]
C105  470n  [0603_SMD_C]
C106  470n  [0603_SMD_C]
C107  470n  [0603_SMD_C]
C108  470n  [0603_SMD_C]
C109  470n  [0603_SMD_C]
C110  470n  [0603_SMD_C]
C111  470n  [0603_SMD_C]
C112  470n  [0603_SMD_C]
C113  470n  [0603_SMD_C]
C114  470n  [0603_SMD_C]
C115  470n  [0603_SMD_C]
C116  470n  [0603_SMD_C]
C117  470n  [0603_SMD_C]
C118  470n  [0603_SMD_C]
C119  470n  [0603_SMD_C]
C120  470n  [0603_SMD_C]
C121  470n  [0603_SMD_C]
C122  470n  [0603_SMD_C]
C123  470n  [0603_SMD_C]
C124  470n  [0603_SMD_C]
C125  470n  [0603_SMD_C]
C126  470n  [0603_SMD_C]
C127  470n  [0603_SMD_C]
C128  470n  [0603_SMD_C]
C129  470n  [0603_SMD_C]
C130  470n  [0603_SMD_C]
C131  470n  [0805_SMD_C]
C132  470n  [0805_SMD_C]
C133  10n  [0805_SMD_C]
C134  10n  [0805_SMD_C]
F1  C1Q_1  [1206_C1Q]
F2  C1Q_1  [1206_C1Q]
F3  C1Q_1  [1206_C1Q]
F4  C1Q_1  [1206_C1Q]
F5  C1Q_1  [1206_C1Q]
F6  C1Q_1  [1206_C1Q]
F7  C1Q_1  [1206_C1Q]
F8  C1Q_1  [1206_C1Q]
F9  C1Q_1  [1206_C1Q]
F10  C1Q_1  [1206_C1Q]
F11  C1Q_1  [1206_C1Q]
F12  C1Q_1  [1206_C1Q]
F13  C1Q_1  [1206_C1Q]
F14  C1Q_1  [1206_C1Q]
F15  C1Q_1  [1206_C1Q]
F16  C1Q_1  [1206_C1Q]
F17  C1Q_1  [1206_C1Q]
F18  C1Q_1  [1206_C1Q]
F19  C1Q_1  [1206_C1Q]
F20  C1Q_1  [1206_C1Q]
F21  C1Q_1  [1206_C1Q]
F22  C1Q_1  [1206_C1Q]
F23  C1Q_1  [1206_C1Q]
F24  C1Q_1  [1206_C1Q]
F25  C1Q_1  [1206_C1Q]
F26  C1Q_1  [1206_C1Q]
F27  C1Q_1  [1206_C1Q]
F28  C1Q_1  [1206_C1Q]
F29  C1Q_1  [1206_C1Q]
F30  C1Q_1  [1206_C1Q]
F31  C1Q_1  [1206_C1Q]
F32  C1Q_1  [1206_C1Q]
F33  C1Q_1  [1206_C1Q]
R32  100  [0603_SMD_R]
R33  100  [0603_SMD_R]
R34  100  [0603_SMD_R]
R35  100  [0603_SMD_R]
R36  100  [0603_SMD_R]
R37  100  [0603_SMD_R]
R38  100  [0603_SMD_R]
R39  100  [0603_SMD_R]
R40  100  [0603_SMD_R]
R41  100  [0603_SMD_R]
R42  100  [0603_SMD_R]
R43  100  [0603_SMD_R]
R44  100  [0603_SMD_R]
R45  100  [0603_SMD_R]
R46  100  [0603_SMD_R]
R47  100  [0603_SMD_R]
R48  0  [1210_SMD_R]
R49  100  [0603_SMD_R]
R50  100  [0603_SMD_R]
R51  100  [0603_SMD_R]
R52  100  [0603_SMD_R]
R53  100  [0603_SMD_R]
R54  100  [0603_SMD_R]
R55  100  [0603_SMD_R]
R56  100  [0603_SMD_R]
R57  100  [0603_SMD_R]
R58  100  [0603_SMD_R]
R59  100  [0603_SMD_R]
R60  100  [0603_SMD_R]
R61  100  [0603_SMD_R]
R62  100  [0603_SMD_R]
R63  100  [0603_SMD_R]
R64  100  [0603_SMD_R]
R65  100  [0603_SMD_R]
R66  10  [1210_SMD_R]
R67  10  [1210_SMD_R]
R68  10  [1210_SMD_R]
R69  10  [1210_SMD_R]
R70  10  [1210_SMD_R]
R71  10  [1210_SMD_R]
R72  10  [1210_SMD_R]
R73  10  [1210_SMD_R]
R74  10  [1210_SMD_R]
R75  10  [1210_SMD_R]
R76  10  [1210_SMD_R]
R77  10  [1210_SMD_R]
R78  10  [1210_SMD_R]
R79  10  [1210_SMD_R]
R80  10  [1210_SMD_R]
R81  10  [1210_SMD_R]
R82  10  [1210_SMD_R]
R83  10  [1210_SMD_R]
R84  10  [1210_SMD_R]
R85  10  [1210_SMD_R]
R86  10  [1210_SMD_R]
R87  10  [1210_SMD_R]
R88  10  [1210_SMD_R]
R89  10  [1210_SMD_R]
R90  10  [1210_SMD_R]
R91  10  [1210_SMD_R]
R92  10  [1210_SMD_R]
R93  10  [1210_SMD_R]
R94  10  [1210_SMD_R]
R95  10  [1210_SMD_R]
R96  10  [1210_SMD_R]
R97  10  [1210_SMD_R]
R98  10  [1210_SMD_R]
R99  30  [0805_SMD_R]
R100  30  [0805_SMD_R]

### Nets
BAT_GND: C81.2 C114.1 R48.1
BQ1_GND: C134.1
BQ2_GND: C133.1
BAT16: C132.2 C134.2 R100.2
BAT32: C131.2 C133.2 R99.2
BT0: F1.1
BT0_F: F1.2 R48.2 R49.1 R82.1
BT1: F2.1
BT1_F: F2.2 R50.1 R83.1
BT2: F3.1
BT2_F: F3.2 R51.1 R84.1
BT3: F4.1
BT3_F: F4.2 R52.1 R85.1
BT4: F5.1
BT4_F: F5.2 R53.1 R86.1
BT5: F6.1
BT5_F: F6.2 R54.1 R87.1
BT6: F7.1
BT6_F: F7.2 R55.1 R88.1
BT7: F8.1
BT7_F: F8.2 R56.1 R89.1
BT8: F9.1
BT8_F: F9.2 R57.1 R90.1
BT9: F10.1
BT9_F: F10.2 R58.1 R91.1
BT10: F11.1
BT10_F: F11.2 R59.1 R92.1
BT11: F12.1
BT11_F: F12.2 R60.1 R93.1
BT12: F13.1
BT12_F: F13.2 R61.1 R94.1
BT13: F14.1
BT13_F: F14.2 R62.1 R95.1
BT14: F15.1
BT14_F: F15.2 R63.1 R96.1
BT15: F16.1
BT15_F: F16.2 R64.1 R97.1
BT16: F17.1
BT16_F: F17.2 R65.1 R98.1 R100.1
BT17: F18.1
BT17_F: F18.2 R32.1 R66.1
BT18: F19.1
BT18_F: F19.2 R33.1 R67.1
BT19: F20.1
BT19_F: F20.2 R34.1 R68.1
BT20: F21.1
BT20_F: F21.2 R35.1 R69.1
BT21: F22.1
BT21_F: F22.2 R36.1 R70.1
BT22: F23.1
BT22_F: F23.2 R37.1 R71.1
BT23: F24.1
BT23_F: F24.2 R38.1 R72.1
BT24: F25.1
BT24_F: F25.2 R39.1 R73.1
BT25: F26.1
BT25_F: F26.2 R40.1 R74.1
BT26: F27.1
BT26_F: F27.2 R41.1 R75.1
BT27: F28.1
BT27_F: F28.2 R42.1 R76.1
BT28: F29.1
BT28_F: F29.2 R43.1 R77.1
BT29: F30.1
BT29_F: F30.2 R44.1 R78.1
BT30: F31.1
BT30_F: F31.2 R45.1 R79.1
BT31: F32.1
BT31_F: F32.2 R46.1 R80.1
BT32: F33.1
BT32_F: F33.2 R47.1 R81.1 R99.1
CB0: C114.2 C115.1 R82.2
CB1: C115.2 C116.1 R83.2
CB2: C116.2 C117.1 R84.2
CB3: C117.2 C118.1 R85.2
CB4: C118.2 C119.1 R86.2
CB5: C119.2 C120.1 R87.2
CB6: C120.2 C121.1 R88.2
CB7: C121.2 C122.1 R89.2
CB8: C122.2 C123.1 R90.2
CB9: C123.2 C124.1 R91.2
CB10: C124.2 C125.1 R92.2
CB11: C125.2 C126.1 R93.2
CB12: C126.2 C127.1 R94.2
CB13: C127.2 C128.1 R95.2
CB14: C128.2 C129.1 R96.2
CB15: C129.2 C130.1 R97.2
CB16: C98.1 C130.2 C132.1 R98.2
CB17: C98.2 C99.1 R66.2
CB18: C99.2 C100.1 R67.2
CB19: C100.2 C101.1 R68.2
CB20: C101.2 C102.1 R69.2
CB21: C102.2 C103.1 R70.2
CB22: C103.2 C104.1 R71.2
CB23: C104.2 C105.1 R72.2
CB24: C105.2 C106.1 R73.2
CB25: C106.2 C107.1 R74.2
CB26: C107.2 C108.1 R75.2
CB27: C108.2 C109.1 R76.2
CB28: C109.2 C110.1 R77.2
CB29: C110.2 C111.1 R78.2
CB30: C111.2 C112.1 R79.2
CB31: C112.2 C113.1 R80.2
CB32: C113.2 C131.1 R81.2
VC0: C81.1 C82.1 R49.2
VC1: C82.2 C83.1 R50.2
VC2: C83.2 C84.1 R51.2
VC3: C84.2 C85.1 R52.2
VC4: C85.2 C86.1 R53.2
VC5: C86.2 C87.1 R54.2
VC6: C87.2 C88.1 R55.2
VC7: C88.2 C89.1 R56.2
VC8: C89.2 C90.1 R57.2
VC9: C90.2 C91.1 R58.2
VC10: C91.2 C92.1 R59.2
VC11: C92.2 C93.1 R60.2
VC12: C93.2 C94.1 R61.2
VC13: C94.2 C95.1 R62.2
VC14: C95.2 C96.1 R63.2
VC15: C96.2 C97.1 R64.2
VC16: C65.1 C97.2 R65.2
VC17: C65.2 C66.1 R32.2
VC18: C66.2 C67.1 R33.2
VC19: C67.2 C68.1 R34.2
VC20: C68.2 C69.1 R35.2
VC21: C69.2 C70.1 R36.2
VC22: C70.2 C71.1 R37.2
VC23: C71.2 C72.1 R38.2
VC24: C72.2 C73.1 R39.2
VC25: C73.2 C74.1 R40.2
VC26: C74.2 C75.1 R41.2
VC27: C75.2 C76.1 R42.2
VC28: C76.2 C77.1 R43.2
VC29: C77.2 C78.1 R44.2
VC30: C78.2 C79.1 R45.2
VC31: C79.2 C80.1 R46.2
VC32: C80.2 R47.2

### Layout directives
net class BT: BT0, BT0_F, BT1, BT1_F, BT2, BT2_F, BT3, BT3_F, BT4, BT4_F, BT5, BT5_F, BT6, BT6_F, BT7, BT7_F, BT8, BT8_F, BT9, BT9_F, BT10, BT10_F, BT11, BT11_F, BT12, BT12_F, BT13, BT13_F, BT14, BT14_F, BT15, BT15_F, BT16, BT16_F, BT17, BT17_F, BT18, BT18_F, BT19, BT19_F, BT20, BT20_F, BT21, BT21_F, BT22, BT22_F, BT23, BT23_F, BT24, BT24_F, BT25, BT25_F, BT26, BT26_F, BT27, BT27_F, BT28, BT28_F, BT29, BT29_F, BT30, BT30_F, BT31, BT31_F, BT32, BT32_F, CB0, CB1, CB2, CB3, CB4, CB5, CB6, CB7, CB8, CB9, CB10, CB11, CB12, CB13, CB14, CB15, CB16, CB17, CB18, CB19, CB20, CB21, CB22, CB23, CB24, CB25, CB26, CB27, CB28, CB29, CB30, CB31, CB32, VC0, VC1, VC2, VC3, VC4, VC5, VC6, VC7, VC8, VC9, VC10, VC11, VC12, VC13, VC14, VC15, VC16, VC17, VC18, VC19, VC20, VC21, VC22, VC23, VC24, VC25, VC26, VC27, VC28, VC29, VC30, VC31, VC32

### Notes on the sheet
- Title
- Generation
- Organization
- Sub Team
- Module
- Ver.
- Rev.
- Date
- Draw By

### Library data of the parts
C65-C130 = 0603_SMD_Capacitor: 0603 SMD Capacitor; Voltage Rating: 16VDC; Tolerance: *; Dielectric: *; Value: 470n
C131-C134 = 0805_SMD_Capacitor: 0805 SMD Capacitor; Voltage Rating: 100VDC; Tolerance: *; Dielectric: *
  C131 C132: Value: 470n
  C133 C134: Value: 10n
F1-F33 = Bel Fuse 1206 1A: T&R; Manufacturer_Name: Bel; Manufacturer_Part_Number: C1Q 1; Geometry.Height: 0.78mm; Mouser Part Number: 530-C1Q1; Mouser Price/Stock: *; Datasheet Link: https://www.mouser.com/datasheet/2/643/ds-CP-c1q-series-1313102.pdf
R32-R47 R49-R65 = 0603_SMD_Resistor: 0603 SMD Resistor; Tolerance: *; Power Rating: *; Temperature Coefficient: *; Value: 100
R48 R66-R98 = 1210_SMD_Resistor: 1210 SMD Resistor; Tolerance: *; Power Rating: *; Temperature Coefficient: *
  R48: Value: 0
  R66-R98: Value: 10
R99 R100 = 0805_SMD_Resistor: 0805 SMD Resistor; Tolerance: *; Power Rating: *; Temperature Coefficient: *; Value: 30

## Sheet BSU_ESD.SchDoc: ESD
size A4; Sub Team: EEE; Organization: PERT; SheetNumber: 6; SheetTotal: 8
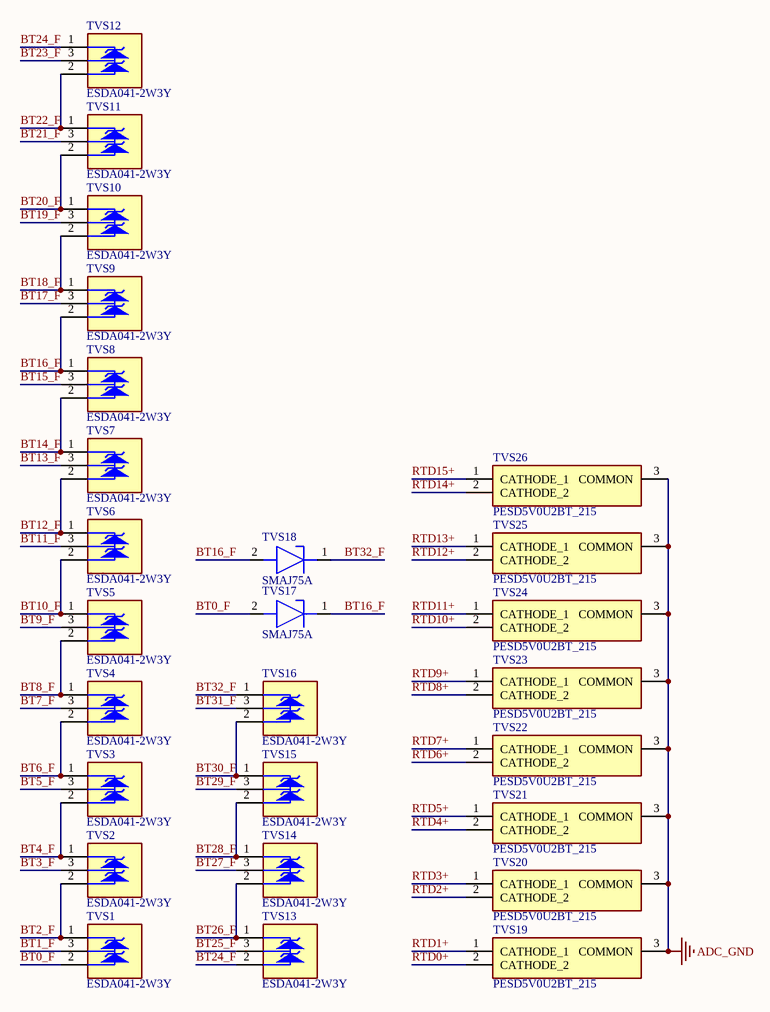
[diagram p5: BSU_ESD.SchDoc]

### Parts
TVS1  ESDA041-2W3Y  [SOT323-3_ESDA041-2W3Y]
TVS2  ESDA041-2W3Y  [SOT323-3_ESDA041-2W3Y]
TVS3  ESDA041-2W3Y  [SOT323-3_ESDA041-2W3Y]
TVS4  ESDA041-2W3Y  [SOT323-3_ESDA041-2W3Y]
TVS5  ESDA041-2W3Y  [SOT323-3_ESDA041-2W3Y]
TVS6  ESDA041-2W3Y  [SOT323-3_ESDA041-2W3Y]
TVS7  ESDA041-2W3Y  [SOT323-3_ESDA041-2W3Y]
TVS8  ESDA041-2W3Y  [SOT323-3_ESDA041-2W3Y]
TVS9  ESDA041-2W3Y  [SOT323-3_ESDA041-2W3Y]
TVS10  ESDA041-2W3Y  [SOT323-3_ESDA041-2W3Y]
TVS11  ESDA041-2W3Y  [SOT323-3_ESDA041-2W3Y]
TVS12  ESDA041-2W3Y  [SOT323-3_ESDA041-2W3Y]
TVS13  ESDA041-2W3Y  [SOT323-3_ESDA041-2W3Y]
TVS14  ESDA041-2W3Y  [SOT323-3_ESDA041-2W3Y]
TVS15  ESDA041-2W3Y  [SOT323-3_ESDA041-2W3Y]
TVS16  ESDA041-2W3Y  [SOT323-3_ESDA041-2W3Y]
TVS17  SMAJ75A  [SMA_SMAJ75A]
TVS18  SMAJ75A  [SMA_SMAJ75A]
TVS19  PESD5V0U2BT_215  [SOT23-3_PESD5V0U2BT]
TVS20  PESD5V0U2BT_215  [SOT23-3_PESD5V0U2BT]
TVS21  PESD5V0U2BT_215  [SOT23-3_PESD5V0U2BT]
TVS22  PESD5V0U2BT_215  [SOT23-3_PESD5V0U2BT]
TVS23  PESD5V0U2BT_215  [SOT23-3_PESD5V0U2BT]
TVS24  PESD5V0U2BT_215  [SOT23-3_PESD5V0U2BT]
TVS25  PESD5V0U2BT_215  [SOT23-3_PESD5V0U2BT]
TVS26  PESD5V0U2BT_215  [SOT23-3_PESD5V0U2BT]

### Nets
ADC_GND: TVS19.3(COMMON) TVS20.3(COMMON) TVS21.3(COMMON) TVS22.3(COMMON) TVS23.3(COMMON) TVS24.3(COMMON) TVS25.3(COMMON) TVS26.3(COMMON)  [project net RTD0-]
BT0_F: TVS1.2(A2) TVS17.2(A)
BT1_F: TVS1.3(A1_/K2)
BT2_F: TVS1.1(K1) TVS2.2(A2)
BT3_F: TVS2.3(A1_/K2)
BT4_F: TVS2.1(K1) TVS3.2(A2)
BT5_F: TVS3.3(A1_/K2)
BT6_F: TVS3.1(K1) TVS4.2(A2)
BT7_F: TVS4.3(A1_/K2)
BT8_F: TVS4.1(K1) TVS5.2(A2)
BT9_F: TVS5.3(A1_/K2)
BT10_F: TVS5.1(K1) TVS6.2(A2)
BT11_F: TVS6.3(A1_/K2)
BT12_F: TVS6.1(K1) TVS7.2(A2)
BT13_F: TVS7.3(A1_/K2)
BT14_F: TVS7.1(K1) TVS8.2(A2)
BT15_F: TVS8.3(A1_/K2)
BT16_F: TVS8.1(K1) TVS9.2(A2) TVS17.1(K) TVS18.2(A)
BT17_F: TVS9.3(A1_/K2)
BT18_F: TVS9.1(K1) TVS10.2(A2)
BT19_F: TVS10.3(A1_/K2)
BT20_F: TVS10.1(K1) TVS11.2(A2)
BT21_F: TVS11.3(A1_/K2)
BT22_F: TVS11.1(K1) TVS12.2(A2)
BT23_F: TVS12.3(A1_/K2)
BT24_F: TVS12.1(K1) TVS13.2(A2)
BT25_F: TVS13.3(A1_/K2)
BT26_F: TVS13.1(K1) TVS14.2(A2)
BT27_F: TVS14.3(A1_/K2)
BT28_F: TVS14.1(K1) TVS15.2(A2)
BT29_F: TVS15.3(A1_/K2)
BT30_F: TVS15.1(K1) TVS16.2(A2)
BT31_F: TVS16.3(A1_/K2)
BT32_F: TVS16.1(K1) TVS18.1(K)
RTD0+: TVS19.2(CATHODE_2)
RTD1+: TVS19.1(CATHODE_1)
RTD2+: TVS20.2(CATHODE_2)
RTD3+: TVS20.1(CATHODE_1)
RTD4+: TVS21.2(CATHODE_2)
RTD5+: TVS21.1(CATHODE_1)
RTD6+: TVS22.2(CATHODE_2)
RTD7+: TVS22.1(CATHODE_1)
RTD8+: TVS23.2(CATHODE_2)
RTD9+: TVS23.1(CATHODE_1)
RTD10+: TVS24.2(CATHODE_2)
RTD11+: TVS24.1(CATHODE_1)
RTD12+: TVS25.2(CATHODE_2)
RTD13+: TVS25.1(CATHODE_1)
RTD14+: TVS26.2(CATHODE_2)
RTD15+: TVS26.1(CATHODE_1)

### Notes on the sheet
- Title
- Generation
- Organization
- Sub Team
- Module
- Ver.
- Rev.
- Date
- Draw By

### Library data of the parts
TVS1-TVS16 = ESDA041-2W3Y: Automotive dual lines 4 V TVS for BMS in SOT323; Manufacturer_Name: STMicroelectronics; Geometry.Height: 1.1mm; Mouser Part Number: 511-ESDA041-2W3Y; Mouser Price/Stock: https://www.mouser.co.uk/ProductDetail/STMicroelectronics/ESDA041-2W3Y?qs=%252B6g0mu59x7IEynpxej3Q0w%3D%3D; Manufacturer_Part_Number: ESDA041-2W3Y; Datasheet Link: https://www.st.com/resource/en/datasheet/esda041-1jy.pdf
TVS17 TVS18 = SMAJ75A: LITTELFUSE - SMAJ75A - TVS Diode, SMAJ Series, Unidirectional, 75 V, 121 V, DO-214AC (SMA), 2 Pins; Geometry.Height: 2.29mm; Mouser Part Number: 576-SMAJ75A; Mouser Price/Stock: https://www.mouser.co.uk/ProductDetail/Littelfuse/SMAJ75A?qs=HR2RnyOI4E7Kp9oudr4VYA%3D%3D; Manufacturer_Name: LITTELFUSE; Manufacturer_Part_Number: SMAJ75A; Datasheet Link: https://altium.componentsearchengine.com/Datasheets/2/SMAJ75A.pdf
TVS19-TVS26 = PESD5V0U2BT_215: PESD5V0U2BT - Ultra low capacitance bidirectional double ESD protection diode; Manufacturer_Name: Nexperia; Manufacturer_Part_Number: PESD5V0U2BT,215; Geometry.Height: 1.1mm; Mouser Part Number: 771-PESD5V0U2BTT/R; Mouser Price/Stock: https://www.mouser.co.uk/ProductDetail/Nexperia/PESD5V0U2BT215?qs=LOCUfHb8d9uKnndgcTorSw%3D%3D; Datasheet Link: https://assets.nexperia.com/documents/data-sheet/PESD5V0U2BT.pdf

## Sheet BSU_EADC.SchDoc: ADC
size A4; Sub Team: EEE; Organization: PERT; SheetNumber: 7; SheetTotal: 8
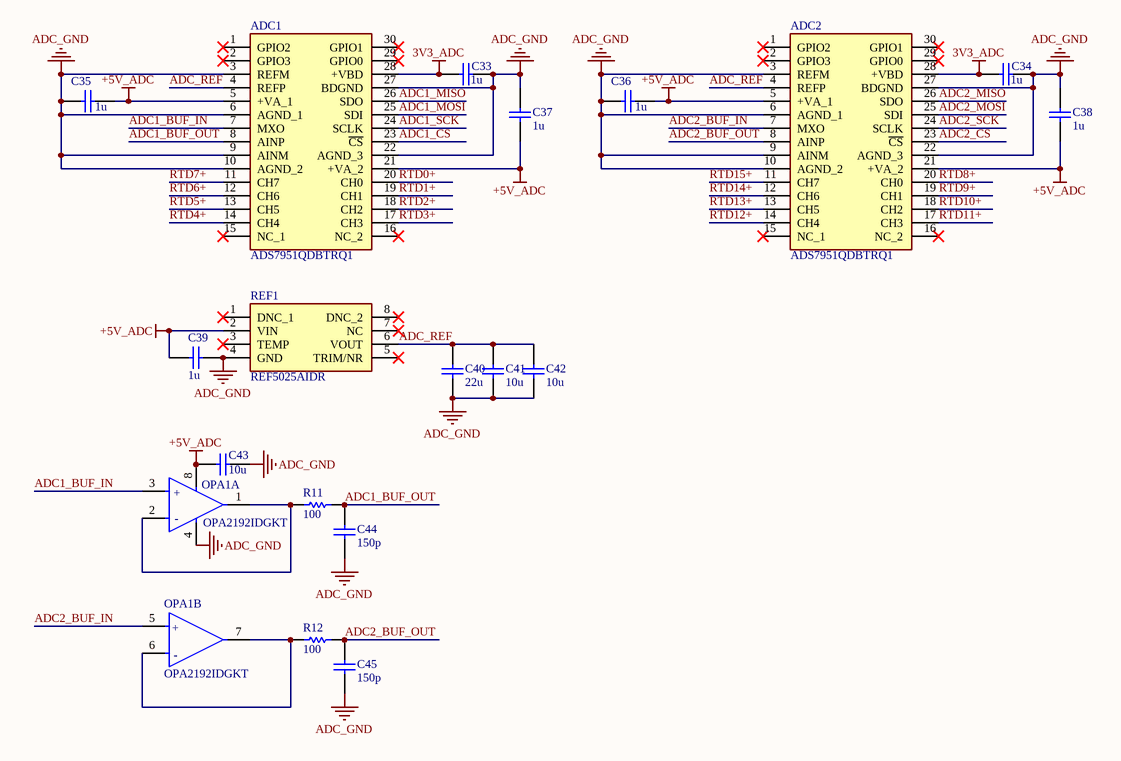
[diagram p6: BSU_EADC.SchDoc]

### Parts
ADC1  ADS7951QDBTRQ1  [TSSOP30_ADS7951]
ADC2  ADS7951QDBTRQ1  [TSSOP30_ADS7951]
C33  1u  [0805_SMD_C]
C34  1u  [0805_SMD_C]
C35  1u  [0805_SMD_C]
C36  1u  [0805_SMD_C]
C37  1u  [0805_SMD_C]
C38  1u  [0805_SMD_C]
C39  1u  [0805_SMD_C]
C40  22u  [0805_SMD_C]
C41  10u  [0805_SMD_C]
C42  10u  [0805_SMD_C]
C43  10u  [0805_SMD_C]
C44  150p  [0805_SMD_C]
C45  150p  [0805_SMD_C]
OPA1  OPA2192IDGKT  [VSSOP8_OPA2192]  (parts A,B of 2)
R11  100  [0805_SMD_R]
R12  100  [0805_SMD_R]
REF1  REF5025AIDR  [SOIC8_REF5025]

### Nets
3V3_ADC: ADC1.28(+VBD) ADC2.28(+VBD) C33.1 C34.1
+5V_ADC: ADC1.5(+VA_1) ADC1.21(+VA_2) ADC2.5(+VA_1) ADC2.21(+VA_2) C35.1 C36.1 C37.2 C38.2 C39.1 C43.2 OPA1.8(VDD) REF1.2(VIN)
ADC_GND: ADC1.3(REFM) ADC1.6(AGND_1) ADC1.9(AINM) ADC1.10(AGND_2) ADC1.22(AGND_3) ADC1.27(BDGND) ADC2.3(REFM) ADC2.6(AGND_1) ADC2.9(AINM) ADC2.10(AGND_2) ADC2.22(AGND_3) ADC2.27(BDGND) C33.2 C34.2 C35.2 C36.2 C37.1 C38.1 C39.2 C40.1 C41.1 C42.1 C43.1 C44.1 C45.1 OPA1.4(GND) REF1.4(GND)  [project net RTD0-]
ADC1_BUF_IN: ADC1.7(MXO) OPA1.3(1IN+)
ADC1_BUF_OUT: ADC1.8(AINP) C44.2 R11.2
ADC1_CS: ADC1.23(~{CS})
ADC1_MISO: ADC1.26(SDO)
ADC1_MOSI: ADC1.25(SDI)
ADC1_SCK: ADC1.24(SCLK)
ADC2_BUF_IN: ADC2.7(MXO) OPA1.5(2IN+)
ADC2_BUF_OUT: ADC2.8(AINP) C45.2 R12.2
ADC2_CS: ADC2.23(~{CS})
ADC2_MISO: ADC2.26(SDO)
ADC2_MOSI: ADC2.25(SDI)
ADC2_SCK: ADC2.24(SCLK)
ADC_REF: ADC1.4(REFP) ADC2.4(REFP) C40.2 C41.2 C42.2 REF1.6(VOUT)
RTD0+: ADC1.20(CH0)
RTD1+: ADC1.19(CH1)
RTD2+: ADC1.18(CH2)
RTD3+: ADC1.17(CH3)
RTD4+: ADC1.14(CH4)
RTD5+: ADC1.13(CH5)
RTD6+: ADC1.12(CH6)
RTD7+: ADC1.11(CH7)
RTD8+: ADC2.20(CH0)
RTD9+: ADC2.19(CH1)
RTD10+: ADC2.18(CH2)
RTD11+: ADC2.17(CH3)
RTD12+: ADC2.14(CH4)
RTD13+: ADC2.13(CH5)
RTD14+: ADC2.12(CH6)
RTD15+: ADC2.11(CH7)
NetOPA1_1: OPA1.1(1OUT) OPA1.2(1IN-) R11.1
NetOPA1_6: OPA1.6(2IN-) OPA1.7(2OUT) R12.1

Not connected (* = marked no-connect by the designer): ADC1 1(GPIO2)* 2(GPIO3)* 15(NC_1)* 16(NC_2)* 29(GPIO0)* 30(GPIO1)*; ADC2 1(GPIO2)* 2(GPIO3)* 15(NC_1)* 16(NC_2)* 29(GPIO0)* 30(GPIO1)*; REF1 1(DNC_1)* 3(TEMP)* 5(TRIM/NR)* 7(NC)* 8(DNC_2)*

### Notes on the sheet
- Title
- Generation
- Organization
- Sub Team
- Module
- Ver.
- Rev.
- Date
- Draw By
- (in symbol OPA2192IDGKT, part A) +; -
- (in symbol OPA2192IDGKT, part B) +; -

### Library data of the parts
ADC1 ADC2 = ADS7951QDBTRQ1: Automotive 12 bit, 1 MSPS, 8 Channel, Single-Ended, SAR ADC; Manufacturer_Name: Texas Instruments; Geometry.Height: 1.2mm; Mouser Part Number: 595-ADS7951QDBTRQ1; Mouser Price/Stock: https://www.mouser.co.uk/ProductDetail/Texas-Instruments/ADS7951QDBTRQ1?qs=gvhpkjpQEVRkli0uavTTsA%3D%3D; Manufacturer_Part_Number: ADS7951QDBTRQ1; Datasheet Link: http://www.ti.com/lit/gpn/ads7951-q1
C33-C45 = 0805_SMD_Capacitor: as C20 on sheet BSU_Power; Tolerance: *; Dielectric: *
  C33-C39: Value: 1u
  C40: Value: 22u
  C41-C43: Value: 10u
  C44 C45: Value: 150p
OPA1 = OPA2192IDGKT: 36-V, Precision, RRIO, Low Offset Voltage, Low Input Bias Current Op Amp With e-trim; Manufacturer_Name: Texas Instruments; Geometry.Height: 1.1mm; Mouser Part Number: 595-OPA2192IDGKT; Mouser Price/Stock: https://www.mouser.co.uk/ProductDetail/Texas-Instruments/OPA2192IDGKT?qs=UPLqB4C8V4F3vjA9o1ZbXA%3D%3D; Manufacturer_Part_Number: OPA2192IDGKT; Datasheet Link: http://www.ti.com/lit/gpn/opa2192
R11 R12 = 0805_SMD_Resistor: 0805 SMD Resistor; Tolerance: *; Power Rating: *; Temperature Coefficient: *; Value: 100
REF1 = REF5025AIDR: 3 Vpp/V Noise, 3 ppm/C Drift Precision Series Voltage Reference; Manufacturer_Name: Texas Instruments; Geometry.Height: 1.75mm; Mouser Part Number: 595-REF5025AIDR; Mouser Price/Stock: https://www.mouser.co.uk/ProductDetail/Texas-Instruments/REF5025AIDR?qs=xL7PkI2RoJ70M4JvRcjI4A%3D%3D; Manufacturer_Part_Number: REF5025AIDR; Datasheet Link: http://www.ti.com/lit/gpn/ref5025

## Sheet BSU_RTD.SchDoc: RTD
size A4; Organization: PERT; SheetNumber: 8; SheetTotal: 8; Sub Team: EEE
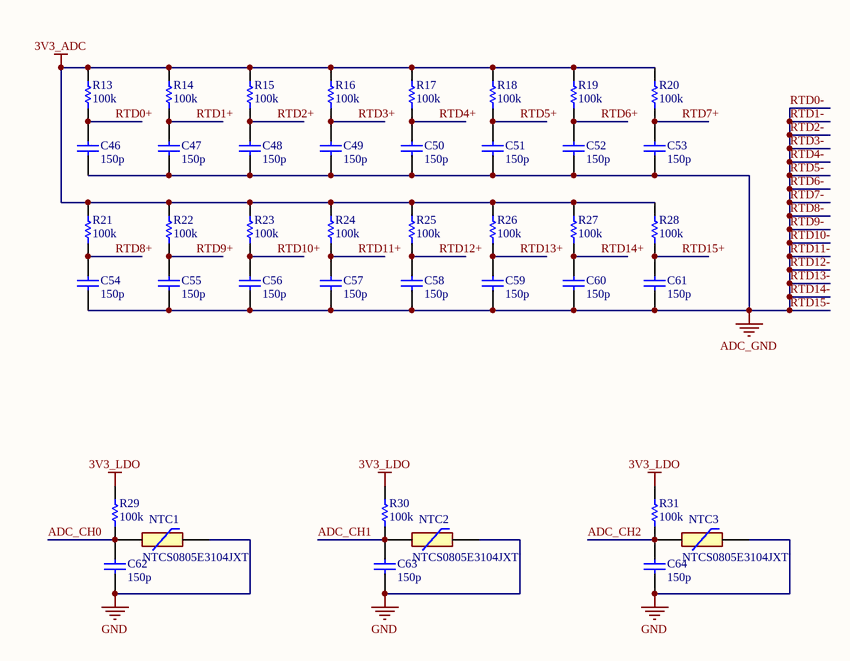
[diagram p7: BSU_RTD.SchDoc]

### Parts
C46  150p  [0603_SMD_C]
C47  150p  [0603_SMD_C]
C48  150p  [0603_SMD_C]
C49  150p  [0603_SMD_C]
C50  150p  [0603_SMD_C]
C51  150p  [0603_SMD_C]
C52  150p  [0603_SMD_C]
C53  150p  [0603_SMD_C]
C54  150p  [0603_SMD_C]
C55  150p  [0603_SMD_C]
C56  150p  [0603_SMD_C]
C57  150p  [0603_SMD_C]
C58  150p  [0603_SMD_C]
C59  150p  [0603_SMD_C]
C60  150p  [0603_SMD_C]
C61  150p  [0603_SMD_C]
C62  150p  [0805_SMD_C]
C63  150p  [0805_SMD_C]
C64  150p  [0805_SMD_C]
NTC1  NTCS0805E3104JXT  [0805_SMD_R]
NTC2  NTCS0805E3104JXT  [0805_SMD_R]
NTC3  NTCS0805E3104JXT  [0805_SMD_R]
R13  100k  [0603_SMD_R]
R14  100k  [0603_SMD_R]
R15  100k  [0603_SMD_R]
R16  100k  [0603_SMD_R]
R17  100k  [0603_SMD_R]
R18  100k  [0603_SMD_R]
R19  100k  [0603_SMD_R]
R20  100k  [0603_SMD_R]
R21  100k  [0603_SMD_R]
R22  100k  [0603_SMD_R]
R23  100k  [0603_SMD_R]
R24  100k  [0603_SMD_R]
R25  100k  [0603_SMD_R]
R26  100k  [0603_SMD_R]
R27  100k  [0603_SMD_R]
R28  100k  [0603_SMD_R]
R29  100k  [0805_SMD_R]
R30  100k  [0805_SMD_R]
R31  100k  [0805_SMD_R]

### Nets
3V3_ADC: R13.2 R14.2 R15.2 R16.2 R17.2 R18.2 R19.2 R20.2 R21.2 R22.2 R23.2 R24.2 R25.2 R26.2 R27.2 R28.2
3V3_LDO: R29.2 R30.2 R31.2
GND: C62.1 C63.1 C64.1 NTC1.1 NTC2.1 NTC3.1
RTD0-: C46.1 C47.1 C48.1 C49.1 C50.1 C51.1 C52.1 C53.1 C54.1 C55.1 C56.1 C57.1 C58.1 C59.1 C60.1 C61.1  [also labelled ADC_GND, RTD1-, RTD10-, RTD11-, RTD12-, RTD13-, RTD14-, RTD15-, RTD2-, RTD3-, RTD4-, RTD5-, RTD6-, RTD7-, RTD8-, RTD9-]
ADC_CH0: C62.2 NTC1.2 R29.1
ADC_CH1: C63.2 NTC2.2 R30.1
ADC_CH2: C64.2 NTC3.2 R31.1
RTD0+: C46.2 R13.1
RTD1+: C47.2 R14.1
RTD2+: C48.2 R15.1
RTD3+: C49.2 R16.1
RTD4+: C50.2 R17.1
RTD5+: C51.2 R18.1
RTD6+: C52.2 R19.1
RTD7+: C53.2 R20.1
RTD8+: C54.2 R21.1
RTD9+: C55.2 R22.1
RTD10+: C56.2 R23.1
RTD11+: C57.2 R24.1
RTD12+: C58.2 R25.1
RTD13+: C59.2 R26.1
RTD14+: C60.2 R27.1
RTD15+: C61.2 R28.1

### Notes on the sheet
- Title
- Generation
- Organization
- Sub Team
- Module
- Ver.
- Rev.
- Date
- Draw By

### Library data of the parts
C46-C61 = 0603_SMD_Capacitor: 0603 SMD Capacitor; Voltage Rating: *; Tolerance: *; Dielectric: *; Value: 150p
C62-C64 = 0805_SMD_Capacitor: 0805 SMD Capacitor; Voltage Rating: *; Tolerance: *; Dielectric: *; Value: 150p
NTC1-NTC3 = 0805_SMD_NTC_Thermistor_100k: NTC Thermistors 100Kohms 5% SMD; Manufacturer_Name: Vishay; Geometry.Height: 0.95mm; Mouser Part Number: 594-NTCS0805E3104JXT; Mouser Price/Stock: https://www.mouser.co.uk/ProductDetail/Vishay-BC-Components/NTCS0805E3104JXT?qs=Y0gyZw6qHXedwsSst0X8tA%3D%3D; Manufacturer_Part_Number: NTCS0805E3104JXT; Datasheet Link: http://www.vishay.com/docs/29044/ntcs0805e3t.pdf
R13-R28 = 0603_SMD_Resistor: 0603 SMD Resistor; Tolerance: *; Power Rating: *; Temperature Coefficient: *; Value: 100k
R29-R31 = 0805_SMD_Resistor: 0805 SMD Resistor; Tolerance: *; Power Rating: *; Temperature Coefficient: *; Value: 100k